# EAGLE design Environment-ArduinoNano33-V10-Middle-KeyChain (EAGLE 7.4.0)
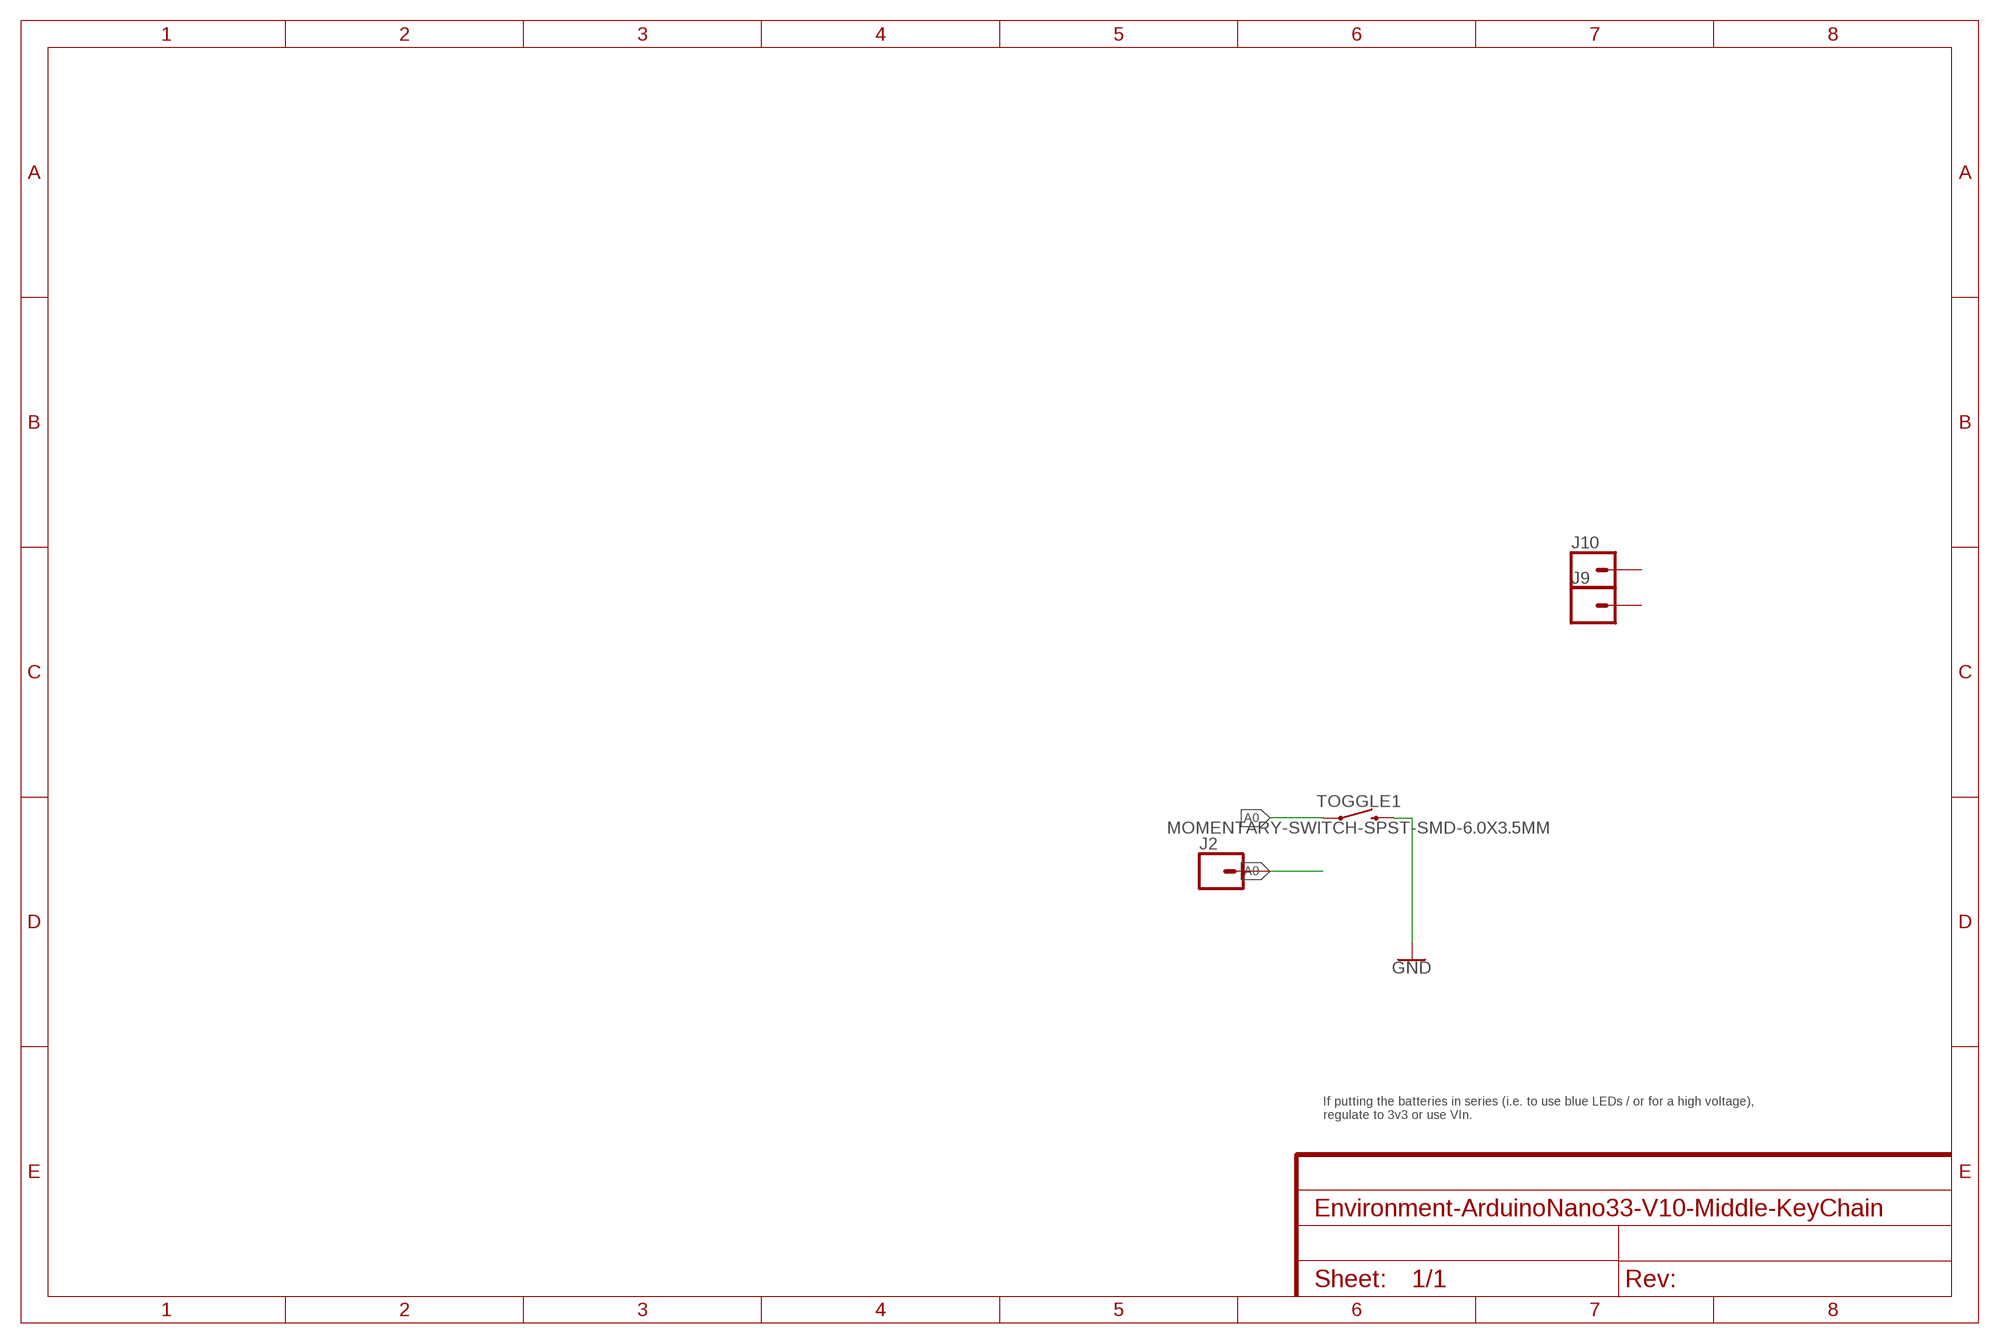
[diagram p0: schematic, sheet 1]

## Parts
J2  CONN_01  [1X01]
J9  CONN_01  [1X01]
J10  CONN_01  [1X01]
TOGGLE1  MOMENTARY-SWITCH-SPST-SMD-6.0X3.5MM  [TACTILE_SWITCH_SMD_6.0X3.5MM]

## Nets
A0: J2.1 TOGGLE1.1
GND: TOGGLE1.2
Unconnected: J9.1 J10.1

## Notes on the sheet
- If putting the batteries in series (i.e. to use blue LEDs / or for a high voltage), 
  regulate to 3v3 or use VIn.

## Library data of the parts
J2 J9 J10 = SparkFun-Connectors:CONN_01: Single connection point. Often used as Generic Header-pin footprint for 0.1 inch spaced/style header connections On any of the 0.1 inch spaced packages, you can populate with these: Break Away Headers - Straight <https://www.sparkfun.com/products/116> (PRT-00116) Break Away Male Headers - Right Angle <https://www.sparkfun.com/products/553> (PRT-00553) Female Headers <https://www.sparkfun.com/products/115> (PRT-00115) Break Away Headers - Machine Pin <https://www.sparkfun.com/products/117> (PRT-00117) Break Away Female Headers - Swiss Machine Pin <https://www.sparkfun.com/products/743> (PRT-00743) This device is also useful as a general connection point to wire up your design to another part of your project. Our various solder wires solder well into these plated through hole pads. Hook-Up Wire - Assortment (Stranded, 22 AWG) <https://www.sparkfun.com/products/11375> (PRT-11375) Hook-Up Wire - Assortment (Solid Core, 22 AWG) <https://www.sparkfun.com/products/11367> (PRT-11367) View the entire wire category on our website here <https://www.sparkfun.com/categories/141> Special notes: SMTSO-256-ET is a "flush mount" nut for a 4-40 screw. We mostly use this on specialty testbeds; it is a nice way to connect hardware to your PCB at an adjustable hieght. Also note, the SNAP packages are for using a snappable style connector. We sell a baggie of snaps and they are also used on two LilyPad designs: Snap Assortment - 30 pack (male and female) <https://www.sparkfun.com/products/11347> (DEV-11347) LilyPad Arduino SimpleSnap <https://www.sparkfun.com/products/10941> (DEV-10941) LilyPad SimpleSnap Protoboard <https://www.sparkfun.com/products/10940> (DEV-10940)
TOGGLE1 = ThingySticks:MOMENTARY-SWITCH-SPST: Momentary Switch (Pushbutton) - SPST Normally-open (NO) SPST momentary switches (buttons, pushbuttons). Variants PTH-12MM - 12mm square, through-hole Momentary Pushbutton Switch - 12mm Square <https://www.sparkfun.com/products/9190> (COM-09190) PTH-6.0MM, PTH-6.0MM-KIT - 6.0mm square, through-hole Mini Pushbutton Switch <https://www.sparkfun.com/products/97> (COM-00097) KIT package intended for soldering kit's - only one side of pads' copper is exposed. PTH-RIGHT-ANGLE-KIT - Right-angle, through-hole Right Angle Tactile Button <https://www.sparkfun.com/products/10791> - Used on SparkFun BigTime Watch Kit <https://www.sparkfun.com/products/11734> SMD-12MM - 12mm square, surface-mount Tactile Button - SMD (12mm) <https://www.sparkfun.com/products/12993> (COM-12993) Used on SparkFun PicoBoard <https://www.sparkfun.com/products/11888> SMD-4.5MM - 4.5mm Square Trackball Switch Used on SparkFun Blackberry Trackballer Breakout <https://www.sparkfun.com/products/13169> SMD-4.6MMX2.8MM - 4.60mm x 2.80mm, surface mount Used on SparkFun SAMD21 Mini Breakout <https://www.sparkfun.com/products/13664> SMD-5.2MM, SMD-5.2-REDUNDANT - 5.2mm square, surface-mount Mini Pushbutton Switch - SMD <https://www.sparkfun.com/products/8720> (COM-08720) Used on Arduino Pro Mini <https://www.sparkfun.com/products/11114> REDUNDANT package connects both switch circuits together SMD-6.0X3.5MM - 6.0 x 3.5mm, surface mount Momentary Reset Switch SMD <https://www.sparkfun.com/products/8229> (COM-08229) SMD-6.2MM-TALL - 6.2mm square, surface mount Tactile Button - SMD (6mm) <https://www.sparkfun.com/products/12992> Used on SparkFun Digital Sandbox <https://www.sparkfun.com/products/12651> SMD-RIGHT-ANGLE - Right-angle, surface mount Used on SparkFun Block for Intel® Edison - Arduino <https://www.sparkfun.com/products/13036>; PROD_ID: SWCH-00815; SF_SKU: COM-08229

## Board
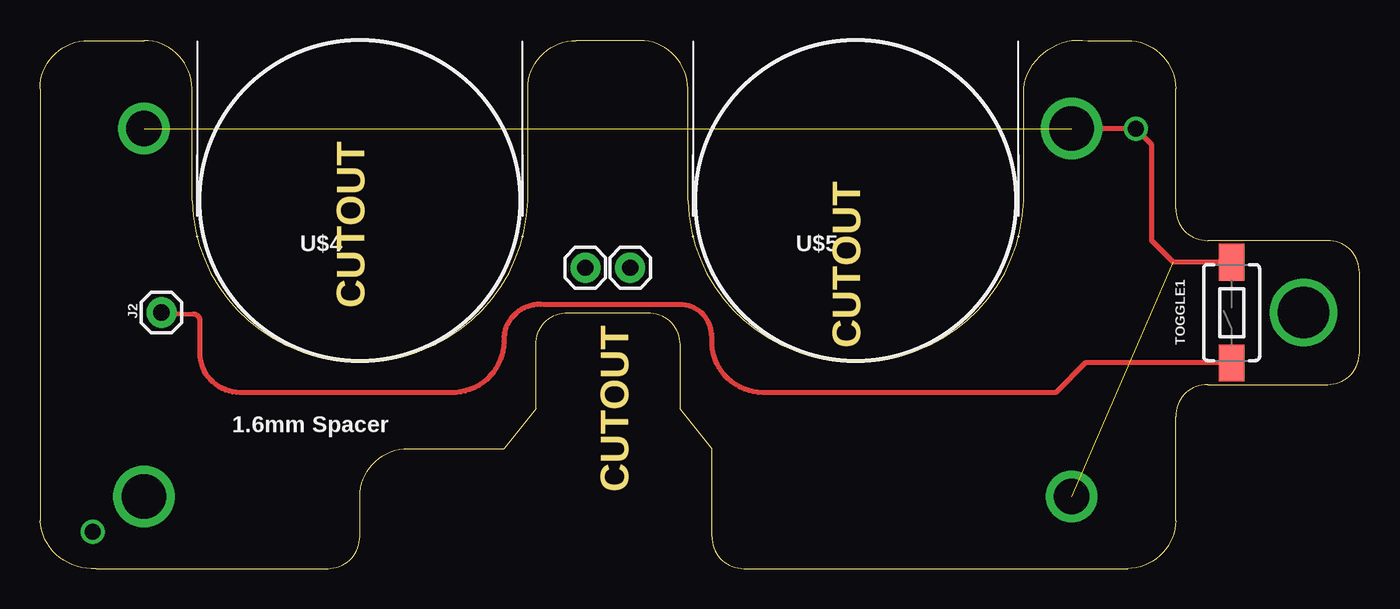
[diagram p1: board, top side]

Size 82.5 x 33.04 mm. Coordinates in mm from the lower left corner, seen from the top.
Outline: 0,30.01 0,3.01 arc90 3.5,0.01 18,0.01 arc90 20,2.01 20,4.51 arc-90 23,7.51 29,7.51 31,10.01 31,14.01 arc-90 33,16.01 38,16.01 arc-90 40,14.01 40,10.01 42,7.51 42,2.01 arc90 44,0.01 68,0.01 arc90 71,3.01 71,9.51 arc-90 73,11.51 80.5,11.51 arc90 82.5,13.51 82.5,18.51 arc90 80.5,20.51 73,20.51 arc-90 71,22.51 71,30.01 arc90 68,33.01 65.5,33.01 arc90 61.5,30.01 61.5,23.01 arc-90 51,13.01 arc-90 40.5,23.01 40.5,30.01 arc90 37.5,33.01 33.5,33.01 arc90 30.5,30.01 30.5,23.01 arc-90 20,13.01 arc-90 9.5,23.01 9.5,30.01 arc90 6.5,33.01 3,33.01 arc90 0,30.01
Copper layers (1*16): Top 0.035mm / dielectric 1.5mm / Bottom 0.035mm
Design rules "dirt_cheap_dirty_boards.v1.1": minimum track width 6mil, minimum drill 12mil, track to track 6mil, track to pad 6mil, pad to pad 6mil, via to via 6mil, smd to smd 0mil, copper to edge 10mil, drill to drill 10mil, minimum pad ring 10mil, minimum via ring 6mil, stop-mask expansion 2mil, vias tented up to drill 25mil, thermal gap 10mil
tKeepout: area 0,-1 to 71,33; area 21.5,0.5 to 28.5,6.5
tRestrict: area 10,15 to 30,35; area 41,13 to 61,33; area 0,-1 to 71,33

### Footprints (pad centres in the part's own frame; a part is rotated, then mirrored left to right if it is on the bottom)
1X01 = drill 1.016 pad 1.88: 1 0,0
TACTILE_SWITCH_SMD_6.0X3.5MM = smd 2.3 x 1.6: 1 -3.15,0; 2 3.15,0

### Placement (x,y rotation side)
J2  7.6,16.01 0 top
J9  34.1,18.81 0 top
J10  36.9,18.81 0 top
TOGGLE1  74.5,16.01 90 top
U$4  CR2032-SPLIT-PCB-MIDDLE  [CR2032-SMD-MIDDLE-OUTLINE]  20,23.01 0 top
U$5  CR2032-SPLIT-PCB-MIDDLE  [CR2032-SMD-MIDDLE-OUTLINE]  51,23.01 0 top

### Tracks (layer width: path | path; a pad name or v marks a point on that pad's centre or on a via)
3.3V1  (via drill 1)
  other vias: 3.3,2.31
A0
  Top 0.305: TOGGLE1.1 65.35,12.86 63.5,11.01 45.5,11.01 arc-90 42,14.01 42,14.51 arc90 40,16.51 31.5,16.51 arc90 29,14.51 arc-90 26,11.01 12.5,11.01 arc-90 10,13.51 10,15.51 arc90 9.6,15.91 J2.1
GND  (via drill 1, 2.2, 2.8)  (2 unrouted)
  Top 0.305: TOGGLE1.2 70.85,19.16 69.5,20.51 69.5,26.51 v68.5,27.51 v64.5,27.51
  other vias: 6.5,27.51 64.5,4.51
N$1  (via drill 2.8)
  other vias: 6.5,4.51
N$42  (via drill 3.2)
  other vias: 79,16.01

### Text on the board
Dimension: CUTOUT | CUTOUT | CUTOUT
tNames: 1.6mm Spacer
Document: Keychain Middle. / Bottom wall slightly smaller to allow for a cover to slide on using the grove | Cable exit / From under PCB to / Front, then up to top | For Enclosure: / Hammon - 1551V2WH - / Plastic Enclosure, Small, ABS, 80 mm, 40 mm, 20 mm, IP30 / / Farnell: 2985869
Reference: 1.6mm PCB | Middle PCB
tDocu: NFC Pads